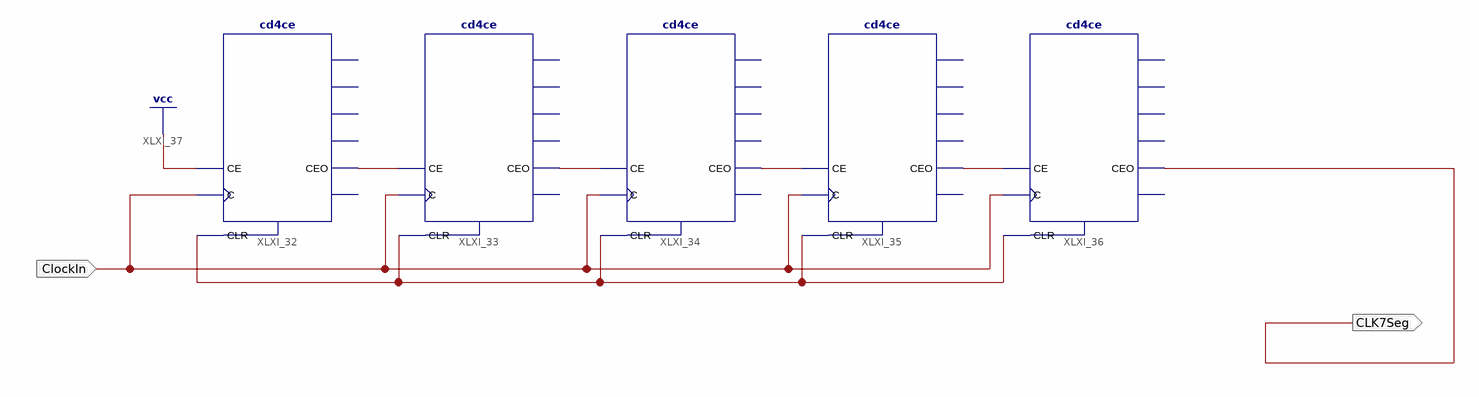
[diagram p0: schematic sheet 1]
// Xilinx ISE schematic ClockDivider.sch (spartan6) as structural Verilog: 5 symbols, 2 ports
module ClockDivider (
  input  ClockIn,
  output CLK7Seg
);

  wire XLXN_46, XLXN_47, XLXN_48, XLXN_50, XLXN_56;

  cd4ce XLXI_32 (.C(ClockIn), .CE(1'b1), .CLR(XLXN_56), .CEO(XLXN_46));  // open: Q0, Q1, Q2, Q3, TC
  cd4ce XLXI_33 (.C(ClockIn), .CE(XLXN_46), .CLR(XLXN_56), .CEO(XLXN_47));  // open: Q0, Q1, Q2, Q3, TC
  cd4ce XLXI_34 (.C(ClockIn), .CE(XLXN_47), .CLR(XLXN_56), .CEO(XLXN_48));  // open: Q0, Q1, Q2, Q3, TC
  cd4ce XLXI_35 (.C(ClockIn), .CE(XLXN_48), .CLR(XLXN_56), .CEO(XLXN_50));  // open: Q0, Q1, Q2, Q3, TC
  cd4ce XLXI_36 (.C(ClockIn), .CE(XLXN_50), .CLR(XLXN_56), .CEO(CLK7Seg));  // open: Q0, Q1, Q2, Q3, TC
endmodule
